# Altium project SDR_PMR.PrjPcb (part 3 of 12)

## Sheet M12_Connector.SchDoc
size A4; DocumentNumber: 1; SheetNumber: 15; SheetTotal: 18
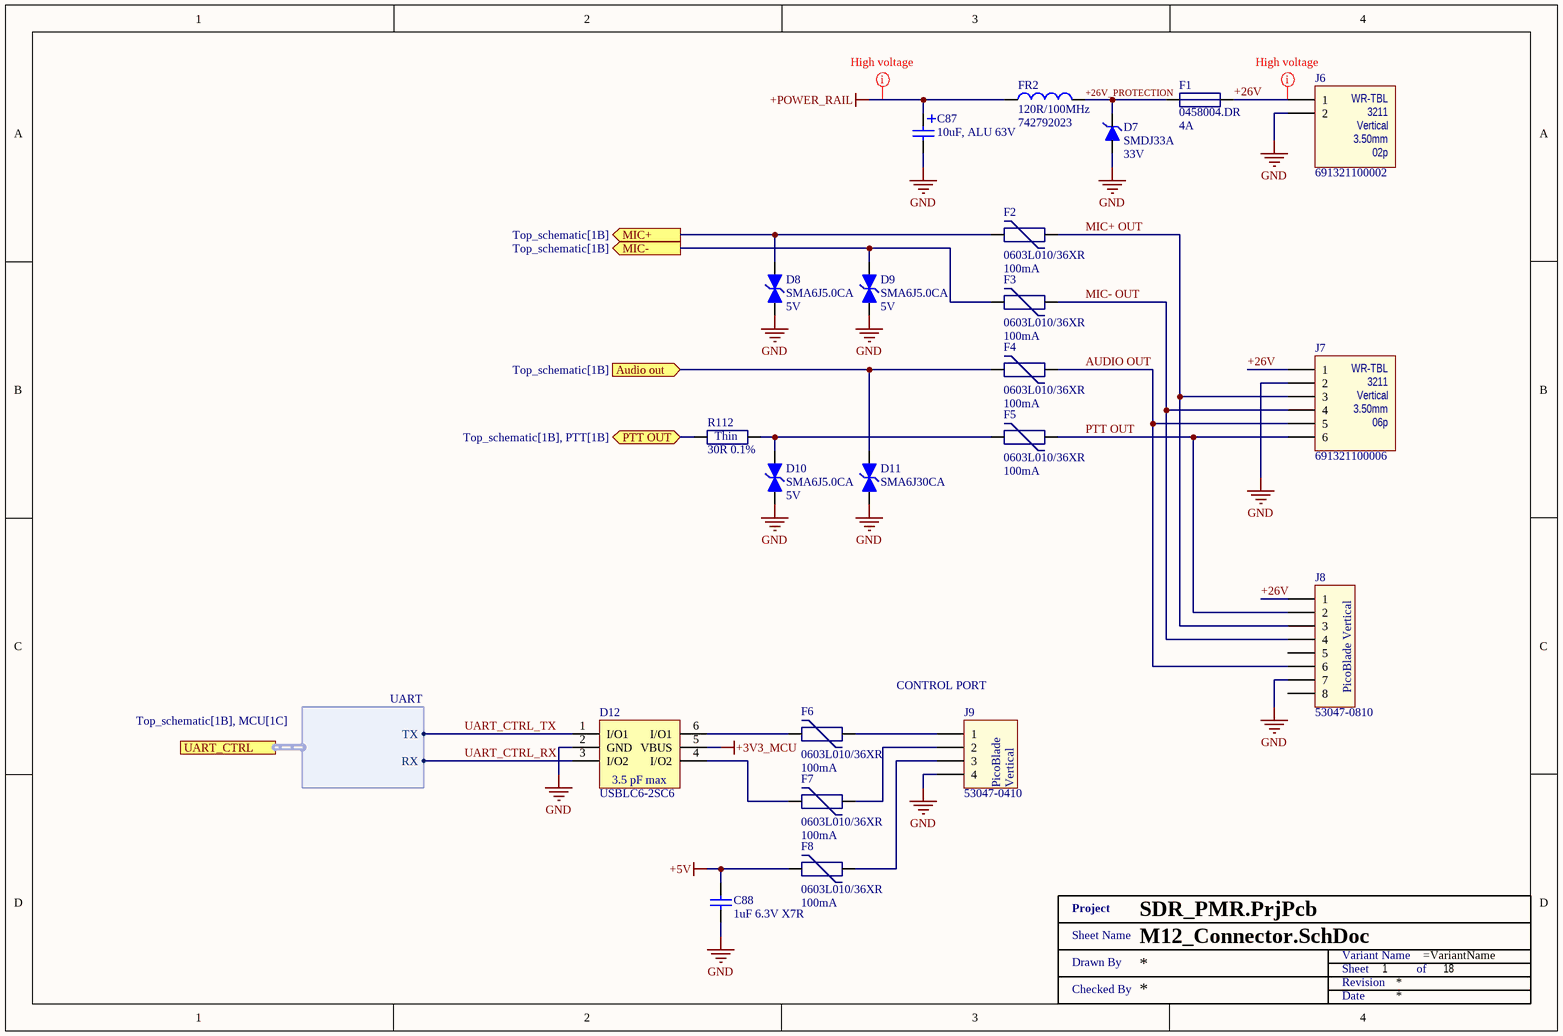
[diagram p2: M12_Connector.SchDoc]

### Parts
(Parts that share a designator on the sheet are numbered #1, #2 ... from top to bottom, then left to right.)
C87  10uF, ALU 63V  [WCAP-ATLI_5x11x2]
C88  1uF 6.3V X7R  [SMD0402]
D7  SMDJ33A  Reverse Standoff Voltage: 33V  [DO-214AB]
D8  SMA6J5.0CA  Reverse Standoff Voltage: 5V  [DO-214AC]
D9  SMA6J5.0CA  Reverse Standoff Voltage: 5V  [DO-214AC]
D10  SMA6J5.0CA  Reverse Standoff Voltage: 5V  [DO-214AC]
D11  SMA6J30CA  [DO-214AC]
D12  USBLC6-2SC6  [SOT23-6L]
F1  0458004.DR  Current Rating: 4A  [SMD1206 - FUSE]
F2  0603L010/36XR  I_hold: 100mA  [SMD0603 - PTC]
F3  0603L010/36XR  I_hold: 100mA  [SMD0603 - PTC]
F4  0603L010/36XR  I_hold: 100mA  [SMD0603 - PTC]
F5  0603L010/36XR  I_hold: 100mA  [SMD0603 - PTC]
F6  0603L010/36XR  I_hold: 100mA  [SMD0603 - PTC]
F7  0603L010/36XR  I_hold: 100mA  [SMD0603 - PTC]
F8  0603L010/36XR  I_hold: 100mA  [SMD0603 - PTC]
FR2  120R/100MHz  [SMD0805 - R]
J6  691321100002  [691321100002]
J7  691321100006  [691321100006]
J8  53047-0810  [530470810]
J9  53047-0410  [530470410]
R112  30R 0.1%  [SMD0402 - R]
XX?#3  Title 1  (value not drawn)  (graphical)

### Ports
Audio out (in, see Top_schematic[1B]), MIC+ (out, see Top_schematic[1B]), MIC- (out, see Top_schematic[1B]), PTT OUT (bidir, see Top_schematic[1B], PTT[1B]), UART_CTRL (harness UART, see Top_schematic[1B], MCU[1C])

### Harnesses
UART: TX, RX

### Nets
+3V3_MCU: D12.5(VBUS)
+5V: C88.2 F8.1
+POWER_RAIL: C87.1 FR2.1
GND: C87.2 C88.1 D7.2 D8.1(A) D9.1(A) D10.1(A) D11.1(A) D12.2(GND) J6.2 J7.2 J8.7 J9.4
+26V: F1.2 J6.1 J7.1 J8.1
+26V_PROTECTION: D7.1 F1.1 FR2.2
AUDIO OUT: F4.2 J7.5 J8.6
MIC+ OUT: F2.2 J7.3 J8.3
MIC- OUT: F3.2 J7.4 J8.4
PTT OUT: F5.2 J7.6 J8.2
UART_CTRL_RX: D12.3(I/O2) ; port UART_CTRL.RX
UART_CTRL_TX: D12.1(I/O1) ; port UART_CTRL.TX
NetC4_1: D9.2(K) F3.1 ; port MIC-
NetC4_2: D8.2(K) F2.1 ; port MIC+
NetC63_2: D11.2(K) F4.1 ; port Audio out
NetD10_2: D10.2(K) F5.1 R112.2
NetD12_4: D12.4(I/O2) F7.1
NetD12_6: D12.6(I/O1) F6.1
NetF6_2: F6.2 J9.1
NetF7_2: F7.2 J9.2
NetF8_2: F8.2 J9.3
NetR109_1: R112.1 ; port PTT OUT

Not connected (* = marked no-connect by the designer): J8 5 8

### Layout directives
net class HV: +26V, +POWER_RAIL

### Notes on the sheet
- (near J9) CONTROL PORT
- (in symbol 53047-0410) PicoBlade; Vertical
- (in symbol 53047-0810) PicoBlade Vertical
- (in symbol 691321100002) WR-TBL; 3211; 3.50mm; 02p
- (in symbol 691321100006) WR-TBL; 3211; 3.50mm; 06p
- (in symbol TC0225B300JTCC) Thin
- (in symbol Title 1) Project; Sheet Name; Variant Name; Drawn By; Sheet; of; Revision; Checked By; Date
- (in symbol USBLC6-2SC6) 3.5 pF max

### Library data of the parts
C87 = 860080772001: WURTH ELEKTRONIK - 860080772001 - CAP, ALU ELEC, 10UF, 63V, RADIAL; Ripple Current: 135mA @ 100kHz; Capacitance: 10u; Manufacturer: WURTH ELEKTRONIK; Manufacturer Part Number: 860080772001; RoHS: YES; Stock 1: 553; Pricing 1: 1=0.0957, 3=0.091, 5=0.0863, 10=0.0825, 20=0.0786, 50=0.0692, 250=0.0647, 500=0.0564 (GBP); ComponentLink1URL: http://www.farnell.com/datasheets/1879798.pdf; ComponentLink1Description: http://www.farnell.com/datasheets/1879798.pdf; Voltage Rating: 63V; Stock 3: 2136; Pricing 3: 1=0.62, 50=0.335, 100=0.289, 250=0.259, 500=0.235, 1500=0.202, 7500=0.182, 15000=0.178 (GBP); ComponentLink2URL: http://www.farnell.com/datasheets/2065186.pdf; ComponentLink2Description: http://www.farnell.com/datasheets/2065186.pdf; Supplier 1: Mouser; Supplier Part Number 1: 710-860080772001; Supplier 2: Farnell; Supplier Part Number 2: 2465955; Supplier 3: Digi-Key; Supplier Part Number 3: 732-9121-1-ND
C88 = TCC0402X7R105K6R3AT: Capacitor: MLCC; SMD; 0402; 1µF; 6.3V; ±10%; X7R; CCTC; Capacitance: 1u; Supplier 1: LCSC; Supplier Part Number 1: C5448871; Manufacturer: CCTC; Manufacturer Part Number: TCC0402X7R105K6R3AT; Category: Ceramic Capacitors; Stock 1: 242350; Pricing 1: 50=0.0089, 500=0.0072, 1500=0.0063, 10000=0.0058, 20000=0.0053, 50000=0.005 (USD); ComponentLink1URL: https://datasheet.octopart.com:443/TCC0402X7R105K6R3AT-CCTC-datasheet-194166649.pdf?src-supplier=LCSC; ComponentLink1Description: https://datasheet.octopart.com:443/TCC0402X7R105K6R3AT-CCTC-datasheet-194166649.pdf?src-supplier=LCSC; ComponentLink2URL: https://datasheet.octopart.com:443/TCC0402X7R105K6R3AT-CCTC-datasheet-192317456.pdf?src-supplier=HQonline; ComponentLink2Description: https://datasheet.octopart.com:443/TCC0402X7R105K6R3AT-CCTC-datasheet-192317456.pdf?src-supplier=HQonline
D7 = SMDJ33A: SMDJ Series 3000 W 33 V Surface Mount Uni-Directional TVS Diode - DO-214AB; Manufacturer: Littelfuse; Number of Unidirectional Channels: 1; Min Breakdown Voltage: 36.7V; Clamping Voltage: 53.3V; Peak Pulse Power: 3kW; Power Line Protection: No; Peak Pulse Current: 56.3A; Polarity: Unidirectional; Test Current: 1mA; Leakage Current: 2uA; Max Breakdown Voltage: 40.6V; Max Power Dissipation: 6.5W; Element Configuration: Single; Supplier 1: Mouser; Supplier Part Number 1: 576-SMDJ33A; Manufacturer Part Number: SMDJ33A; RoHS: Yes; Category: TVS Diodes; Stock 1: 163; Pricing 1: 1=0.96000, 10=0.85500, 50=0.85500, 100=0.66700, 1000=0.42200, 10000=0.40800 (USD); Mount: Surface Mount; Case/Package: SMC; Number of Pins: 2; Min Operating Temperature: -65°C; Max Operating Temperature: 150°C; Packaging: Tape and Reel; Resistor Type: Zener; Reverse Breakdown Voltage: 36.7V; Package Quantity: 3000; Number of Elements: 1; Direction: Unidirectional; Operating Supply Voltage: 33V; Max Surge Current: 56.3A; Breakdown Voltage: 36.7V; Number of Channels: 1; Termination: SMD/SMT; Power Dissipation: 3kW; Max Reverse Leakage Current: 2uA; Length: 7.11mm; Width: 6.22mm; Height: 2.417mm; RoHS Compliant: Yes; Lead Free: Lead Free; REACH SVHC: No SVHC; ComponentLink1URL: https://datasheet.ciiva.com/25624/0900766b810f4f0f-25624824.pdf?src-supplier=RSComponents; ComponentLink1Description: https://datasheet.ciiva.com/25624/0900766b810f4f0f-25624824.pdf?src-supplier=RSComponents; ComponentLink2URL: https://datasheet.ciiva.com/16487/littelfuse-tvs-diode-smdj-datasheet-16487922.pdf?src-supplier=Future+Electronics; ComponentLink2Description: https://datasheet.ciiva.com/16487/littelfuse-tvs-diode-smdj-datasheet-16487922.pdf?src-supplier=Future+Electronics; ComponentLink3URL: https://datasheet.ciiva.com/14162/smdj-eng-ds-14162013.pdf?src-supplier=Distrelec; ComponentLink3Description: https://datasheet.ciiva.com/14162/smdj-eng-ds-14162013.pdf?src-supplier=Distrelec; ComponentLink4URL: https://datasheet.ciiva.com/8062/littelfuse-tvs-diodes-smdj-8062394.pdf?src-supplier=Element14; ComponentLink4Description: https://datasheet.ciiva.com/8062/littelfuse-tvs-diodes-smdj-8062394.pdf?src-supplier=Element14; ComponentLink5URL: https://datasheet.ciiva.com/4510/littelfuse-tvs-diode-smdj-datasheet-pdf-4510185.pdf?src-supplier=Mouser; ComponentLink5Description: https://datasheet.ciiva.com/4510/littelfuse-tvs-diode-smdj-datasheet-pdf-4510185.pdf?src-supplier=Mouser; ComponentLink6URL: https://datasheet.ciiva.com/332/littelfuse-tvs-diode-smdj-datasheet-pdf-332697.pdf?src-supplier=Digi-Key; ComponentLink6Description: https://datasheet.ciiva.com/332/littelfuse-tvs-diode-smdj-datasheet-pdf-332697.pdf?src-supplier=Digi-Key; ComponentLink7URL: https://datasheet.ciiva.com/332/littelfuse-tvs-diode-smdj-datasheet-pdf-332698.pdf?src-supplier=Digi-Key; ComponentLink7Description: https://datasheet.ciiva.com/332/littelfuse-tvs-diode-smdj-datasheet-pdf-332698.pdf?src-supplier=Digi-Key; ComponentLink8URL: https://datasheet.ciiva.com/332/littelfuse-tvs-diode-smdj-datasheet-pdf-332696.pdf?src-supplier=Digi-Key; ComponentLink8Description: https://datasheet.ciiva.com/332/littelfuse-tvs-diode-smdj-datasheet-pdf-332696.pdf?src-supplier=Digi-Key; Supplier 2: Farnell; Supplier Part Number 2: 1827630; Supplier 3: RSComponents; Supplier Part Number 3: 7645717P
D8-D10 = SMA6J5.0CA: ESD Suppressors / TVS Diodes 600W 5V 5% Bi-Directional; Manufacturer: Littelfuse; Supplier 1: Mouser; Supplier Part Number 1: 576-SMA6J5.0CA; Manufacturer Part Number: SMA6J5.0CA; RoHS: Yes; Category: TVS Diodes; Stock 1: 57321; Pricing 1: 1=0.41, 10=0.35, 50=0.35, 100=0.243, 1000=0.139, 10000=0.115 (USD); ComponentLink1URL: http://www.farnell.com/datasheets/2736094.pdf?src-supplier=Farnell; ComponentLink1Description: http://www.farnell.com/datasheets/2736094.pdf?src-supplier=Farnell; ComponentLink2URL: https://datasheet.octopart.com/SMA6J5.0CA-Littelfuse-datasheet-114785799.pdf?src-supplier=Future+Electronics; ComponentLink2Description: https://datasheet.octopart.com/SMA6J5.0CA-Littelfuse-datasheet-114785799.pdf?src-supplier=Future+Electronics; ComponentLink3URL: https://www.littelfuse.com/~/media/electronics/datasheets/tvs_diodes/littelfuse_tvs_diode_sma6j_datasheet.pdf.pdf?src-supplier=Digi-Key; ComponentLink3Description: https://www.littelfuse.com/~/media/electronics/datasheets/tvs_diodes/littelfuse_tvs_diode_sma6j_datasheet.pdf.pdf?src-supplier=Digi-Key; ComponentLink4URL: http://www.farnell.com/datasheets/2736094.pdf?src-supplier=Newark; ComponentLink4Description: http://www.farnell.com/datasheets/2736094.pdf?src-supplier=Newark; ComponentLink5URL: http://www.farnell.com/datasheets/2736094.pdf?src-supplier=Element14; ComponentLink5Description: http://www.farnell.com/datasheets/2736094.pdf?src-supplier=Element14; Supplier 2: Farnell; Supplier Part Number 2: 3010381; Supplier 3: Digi-Key; Supplier Part Number 3: 18-SMA6J5.0CACT-ND
D11 = SMA6J30CA: TVS DIODE 30VWM 48.4VC DO214 TR / 48.4V Clamp 12.5A Ipp Tvs Diode Surface Mount DO-214AC (SMA); Manufacturer: Littelfuse; Breakdown Voltage: 35.05V; Max Breakdown Voltage: 33.3V; Max Power Dissipation: 3.3W; Max Reverse Leakage Current: 1µA; Number of Channels: 1; Peak Pulse Power: 600W; Polarity: Bidirectional; Reverse Standoff Voltage: 30V; Test Current: 1mA; Manufacturer Part Number: SMA6J30CA; RoHS: Compliant; Category: TVS Diodes; Stock 1: 7847; Pricing 1: 1=0.57, 10=0.348, 50=0.348, 100=0.222, 1000=0.15, 10000=0.104 (USD); Clamping Voltage: 48.4V; Country of Origin: Malaysia; Export Control Classification Number (ECCN) Code: EAR99; Harmonized Tariff Schedule (HTS) Code: 8541.10.00.50; Introduction Date: 2017-10-30; Lifecycle Status: Production; Max Operating Temperature: 150°C; Min Breakdown Voltage: 33.3V; Min Operating Temperature: -65°C; Number of Elements: 1; Number of Terminals: 2; Peak Pulse Current: 12.5A; Peak Reverse Current: 1µA; REACH SVHC: No; Reverse Voltage: 30V; ComponentLink1URL: https://datasheet.octopart.com:443/SMA6J30CA-Littelfuse-datasheet-158204057.pdf?src-supplier=IHS; ComponentLink1Description: https://datasheet.octopart.com:443/SMA6J30CA-Littelfuse-datasheet-158204057.pdf?src-supplier=IHS; ComponentLink2URL: https://datasheet.octopart.com:443/SMA6J30CA-Littelfuse-datasheet-159141416.pdf?src-supplier=Newark; ComponentLink2Description: https://datasheet.octopart.com:443/SMA6J30CA-Littelfuse-datasheet-159141416.pdf?src-supplier=Newark; ComponentLink3URL: https://datasheet.octopart.com:443/SMA6J30CA-Littelfuse-datasheet-178267327.pdf?src-supplier=Burklin+Elektronik; ComponentLink3Description: https://datasheet.octopart.com:443/SMA6J30CA-Littelfuse-datasheet-178267327.pdf?src-supplier=Burklin+Elektronik; ComponentLink4URL: https://datasheet.octopart.com:443/SMA6J30CA-Littelfuse-datasheet-114785799.pdf?src-supplier=Littelfuse+SCT; ComponentLink4Description: https://datasheet.octopart.com:443/SMA6J30CA-Littelfuse-datasheet-114785799.pdf?src-supplier=Littelfuse+SCT; Supplier 1: Mouser; Supplier Part Number 1: 576-SMA6J30CA; Supplier 2: LCSC; Supplier Part Number 2: C1977655
D12 = USBLC6-2SC6: STMicroelectronics Uni-Directional TVS Diode Array, 17V Vcl Max, SMD, SOT-23, 6V Vbr Min; Value: 2.5pF; Data Rate: 480Mbps; Direction: Unidirectional; Element Configuration: Dual; ESD Protection: Yes; Forward Voltage: 1.1V; Leakage Current: 150nA; Max Junction Temperature (Tj): 125°C; Max Repetitive Reverse Voltage (Vrrm): 5.25V; Number of Bidirectional Channels: 2; Number of Elements: 1; Peak Pulse Current: 5A; Reverse Standoff Voltage: 5V; Test Current: 1mA; Manufacturer: STMicroelectronics; Manufacturer Part Number: USBLC6-2SC6; RoHS: Compliant; Category: TVS Diodes; Pricing 1: 1=0.47, 10=0.292, 50=0.292, 100=0.204, 500=0.131, 1000=0.14, 3000=0.094, 6000=0.085, 9000=0.081, 10000=0.086, 24000=0.073 (USD); Breakdown Voltage: 6V; Case/Package: SOT-23; China RoHS: Compliant; Clamping Voltage: 17V; Contact Plating: Tin; Country of Origin: Mainland China; Depth: 1.75mm; Export Control Classification Number (ECCN) Code: EAR99; Height: 1.45mm; Harmonized Tariff Schedule (HTS) Code: 8541.10.00.50; Introduction Date: 2005-03-15; Lead Free: Lead Free; Length: 3.05mm; Lifecycle Status: Production; Max Breakdown Voltage: 6V; Max Operating Temperature: 125°C; Max Reverse Leakage Current: 150nA; Min Breakdown Voltage: 6V; Min Operating Temperature: -40°C; Mounting Technology: Surface Mount; Number of Channels: 2; Pins: 6; Number of Terminals: 6; Operating Supply Voltage: 1.1V; Peak Reverse Current: 150nA; Polarity: Unidirectional; Power Line Protection: Yes; Radiation Hardening: No; REACH SVHC: Yes; Reverse Breakdown Voltage: 6V; Schedule B: 8536300000, 8536300000|8536300000|8536300000|8536300000|8536300000|8536300000|8536300000|8536300000|8536300000|8536300000|8536300000|8536300000|8536300000|8536300000|8536300000|8536300000|8536300000|8536300000|8536300000|8536300000|8536300000|8536300000|8536300000|85; Termination: SMD/SMT; Width: 1.75mm; Working Voltage: 5V; ComponentLink1URL: https://datasheet.octopart.com:443/USBLC6-2SC6-STMicroelectronics-datasheet-10412581.pdf?src-supplier=Newark; ComponentLink1Description: https://datasheet.octopart.com:443/USBLC6-2SC6-STMicroelectronics-datasheet-10412581.pdf?src-supplier=Newark; ComponentLink2URL: https://datasheet.octopart.com:443/USBLC6-2SC6-STMicroelectronics-datasheet-181961833.pdf?src-supplier=Newark; ComponentLink2Description: https://datasheet.octopart.com:443/USBLC6-2SC6-STMicroelectronics-datasheet-181961833.pdf?src-supplier=Newark; ComponentLink3URL: https://datasheet.octopart.com:443/USBLC6-2SC6-STMicroelectronics-datasheet-525477.pdf?src-supplier=Factory+Futures; ComponentLink3Description: https://datasheet.octopart.com:443/USBLC6-2SC6-STMicroelectronics-datasheet-525477.pdf?src-supplier=Factory+Futures; ComponentLink4URL: https://datasheet.octopart.com:443/USBLC6-2SC6-STMicroelectronics-datasheet-82998616.pdf?src-supplier=Farnell; ComponentLink4Description: https://datasheet.octopart.com:443/USBLC6-2SC6-STMicroelectronics-datasheet-82998616.pdf?src-supplier=Farnell; ComponentLink5URL: https://datasheet.octopart.com:443/USBLC6-2SC6-STMicroelectronics-datasheet-46285.pdf?src-supplier=Farnell; ComponentLink5Description: https://datasheet.octopart.com:443/USBLC6-2SC6-STMicroelectronics-datasheet-46285.pdf?src-supplier=Farnell; ComponentLink6URL: https://datasheet.octopart.com:443/USBLC6-2SC6-STMicroelectronics-datasheet-14050643.pdf?src-supplier=iiiC; ComponentLink6Description: https://datasheet.octopart.com:443/USBLC6-2SC6-STMicroelectronics-datasheet-14050643.pdf?src-supplier=iiiC; ComponentLink7URL: https://datasheet.octopart.com:443/USBLC6-2SC6-STMicroelectronics-datasheet-10521292.pdf?src-supplier=Jameco+(USA); ComponentLink7Description: https://datasheet.octopart.com:443/USBLC6-2SC6-STMicroelectronics-datasheet-10521292.pdf?src-supplier=Jameco+(USA); Supplier 1: Mouser; Supplier Part Number 1: 511-USBLC6-2SC6; Supplier 2: LCSC; Supplier Part Number 2: C2687116
F1 = 0458004.DR: FUSE BRD MNT 4A 32VAC 75VDC 1206; Manufacturer: Littelfuse; Voltage Rating (AC): 32V; Voltage Rating (DC): 75V; Resistance: 32mR; Fuse Type: Board Mount (Cartridge Style Excluded); Approvals: cULus; Supplier 1: Mouser; Supplier Part Number 1: 576-0458004.DR; Manufacturer Part Number: 0458004.DR; Stock 1: 3670; Pricing 1: 1 = 1.36000, 10 = 1.03000, 50 = 1.03000, 100 = 0.85300, 1000 = 0.70300, 10000 = 0.50800 (USD); RoHS: Yes; Mount: Surface Mount; Case/Package: 1206; Number of Pins: 2; Case Code (Metric): 3216; Case Code (Imperial): 1206; Housing Material: Ceramic; Min Operating Temperature: -55°C; Max Operating Temperature: 125°C; Packaging: Tape and Reel; Package Quantity: 1500; DC Cold Resistance: 32mR; Fuse Current: 4A; Length: 3.18mm; Height: 0.062inch; Width: 1.575mm; Depth: 1.58mm; Radiation Hardening: No; REACH SVHC: Unknown; ComponentLink1URL: https://datasheet.ciiva.com/26923/getdatasheetpartid-767176-26923399.pdf?src-supplier=Verical; ComponentLink1Description: https://datasheet.ciiva.com/26923/getdatasheetpartid-767176-26923399.pdf?src-supplier=Verical; ComponentLink2URL: https://datasheet.ciiva.com/299/littelfuse-fuse-458-series-299817.pdf?src-supplier=Digi-Key; ComponentLink2Description: https://datasheet.ciiva.com/299/littelfuse-fuse-458-series-299817.pdf?src-supplier=Digi-Key; ComponentLink3URL: https://datasheet.ciiva.com/299/littelfuse-fuse-458-series-299818.pdf?src-supplier=Digi-Key; ComponentLink3Description: https://datasheet.ciiva.com/299/littelfuse-fuse-458-series-299818.pdf?src-supplier=Digi-Key; ComponentLink4URL: https://datasheet.ciiva.com/1730/337915-1730546.pdf?src-supplier=Newark; ComponentLink4Description: https://datasheet.ciiva.com/1730/337915-1730546.pdf?src-supplier=Newark; ComponentLink5URL: https://datasheet.ciiva.com/1549/1846043-1549636.pdf?src-supplier=Element14; ComponentLink5Description: https://datasheet.ciiva.com/1549/1846043-1549636.pdf?src-supplier=Element14; ComponentLink6URL: https://datasheet.ciiva.com/299/littelfuse-fuse-458-series-299816.pdf?src-supplier=Digi-Key; ComponentLink6Description: https://datasheet.ciiva.com/299/littelfuse-fuse-458-series-299816.pdf?src-supplier=Digi-Key; Supplier 2: Farnell; Supplier Part Number 2: 1702535; Stock 2: 1286; Supplier 3: Arrow; Supplier Part Number 3: 0458004.DR; Stock 3: 1320; Pricing 3: 1 = 1.18390, 10 = 1.00720, 25 = 1.00660, 100 = 0.75800, 250 = 0.68220, 500 = 0.67760, 1000 = 0.67740 (USD); Supplier 4: Digi-Key; Supplier Part Number 4: F2936CT-ND; Stock 4: 11028; Pricing 4: 1 = 1.43000, 5 = 1.38400, 10 = 1.29500, 50 = 1.07180, 100 = 0.89320, 250 = 0.87088, 500 = 0.73690 (USD)
F2-F8 = 0603L010/36XR: PTC RESET FUSE 36V 100mA 0603; I trip: 300mA; Supplier 1: LCSC; Supplier Part Number 1: C7472522; V max: 36V
FR2 = 742792023: WURTH ELEKTRONIK - 742792023 - FERRITE BEAD, 0.03OHM, 3A, 0805; Impedance @ 100MHz: 120; Ferrite Case Style: 0805 [2012 Metric]; DC Current Rating: 3; DC Resistance Max: 0.03; Impedance Tolerance: ± 25%; Ferrite Mounting: SMD; Resistance: 0.03ohm<!--FANDB--><div class="features-and-benefits-container"><div class="features-and-benefits-description"><span class="features-benefits-value">The 742792023 is a SMD EMI Suppression Ferrite Bead with 0805 case and reliable Ni-Sn electrodes. It can be put directly on the printed circuit board. It offers excellent anti-EMI properties and low DC resistance. Placed very close next to the interference source even with smallest size 0402, maximal impedance at 1000; Manufacturer: WURTH ELEKTRONIK; RoHS: YES; Stock 1: 4283; Pricing 1: 1=0,123, 50=0,112, 100=0,103, 500=0,0937, 1000=0,0877, 2000=0,0846 (GBP); Product Range: -; Automotive Qualification Standard: -; Packaging: Cut Tape; ComponentLink1URL: http://www.farnell.com/datasheets/1695980.pdf; ComponentLink1Description: http://www.farnell.com/datasheets/1695980.pdf; ComponentLink2URL: http://www.farnell.com/cad/1670054.zip; ComponentLink2Description: http://www.farnell.com/cad/1670054.zip; Supplier 1: Mouser; Supplier Part Number 1: 710-742792023; Supplier 2: Farnell; Supplier Part Number 2: 1635732; Supplier 3: Digi-Key; Supplier Part Number 3: 732-1613-1-ND; Manufacturer Part Number: 742792023
J6 = 691321100002: WR-TBL Series 3211 - 3.50 mm Vertical PCB Header; Manufacturer: Wurth Electronics; Number of Positions Per Level: 2; Number of Levels: 1; Current: 10A; Voltage: 300V; Pitch: 0.138inch; Supplier: Mouser; Supplier Part Number: 710-691321100002; Manufacturer Part Number: 691321100002; RoHS: Yes; Category: Terminal Blocks; Stock: 2512; Pricing: 1=0.44, 10=0.394, 50=0.34, 100=0.305, 1000=0.269, 10000=0.268 (USD); Mounting Technology: Through Hole; Color: Green; Contact Material: Brass; Package Quantity: 1000; Packaging: Bulk; Number of Rows: 1; Termination: Solder; Number of Contacts: 2; Orientation: Vertical; Series: WR-TBL Series 3211; Voltage Rating: 300V; Length: 7mm; Width: 8.1mm; Height: 12.7mm; RoHS Compliant: Yes; Reach SVHC Compliant: Unknown; Lead Free: 5697LeadFree; ComponentLink1URL: https://datasheet.ciiva.com/8043/1442231-8043542.pdf?src-supplier=Element14; ComponentLink1Description: https://datasheet.ciiva.com/8043/1442231-8043542.pdf?src-supplier=Element14; ComponentLink2URL: https://datasheet.ciiva.com/795/6913211000xx-795780.pdf?src-supplier=Digikey; ComponentLink2Description: https://datasheet.ciiva.com/795/6913211000xx-795780.pdf?src-supplier=Digikey; ComponentLink3URL: https://datasheet.ciiva.com/48692/001088697-da-01-en-wr-tbl-terminal-block3211-691321100002-48692842.pdf?src-supplier=Conrad; ComponentLink3Description: https://datasheet.ciiva.com/48692/001088697-da-01-en-wr-tbl-terminal-block3211-691321100002-48692842.pdf?src-supplier=Conrad; Supplier 1: Mouser; Supplier Part Number 1: 710-691321100002; Supplier 2: Farnell; Supplier Part Number 2: 1841308; Supplier 3: Digikey; Supplier Part Number 3: 732-2763-ND
J7 = 691321100006: WR-TBL Series 3211 - 3.50 mm Vertical PCB Header; Manufacturer: Wurth Electronics; Current Rating: 10.5A; Number of Positions Per Level: 6; Number of Levels: 1; Current: 10A; Voltage: 300V; Pitch: 0.138inch; Supplier: Mouser; Supplier Part Number: 710-691321100006; Manufacturer Part Number: 691321100006; RoHS: Yes; Category: Terminal Blocks; Stock: 612; Pricing: 1=1.32, 10=1.18, 50=1.02, 100=0.914, 1000=0.805, 10000=0.804 (USD); Mounting Technology: Through Hole; Color: Green; Contact Material: Brass; Number of Rows: 1; Package Quantity: 520; Packaging: Bulk; Termination: Solder; Number of Contacts: 6; Contact Gender: Male; Orientation: Vertical; Series: WR-TBL Series 3211; Length: 7mm; Width: 25.6mm; Height: 12.7mm; RoHS Compliant: Yes; Reach SVHC Compliant: Unknown; ComponentLink1URL: https://datasheet.ciiva.com/8043/1442231-8043549.pdf?src-supplier=Element14; ComponentLink1Description: https://datasheet.ciiva.com/8043/1442231-8043549.pdf?src-supplier=Element14; ComponentLink2URL: https://datasheet.ciiva.com/796/6913211000xx-796060.pdf?src-supplier=Digikey; ComponentLink2Description: https://datasheet.ciiva.com/796/6913211000xx-796060.pdf?src-supplier=Digikey; ComponentLink3URL: https://datasheet.ciiva.com/48692/001088701-da-01-en-wr-tbl-terminal-block3211-691321100006-48692844.pdf?src-supplier=Conrad; ComponentLink3Description: https://datasheet.ciiva.com/48692/001088701-da-01-en-wr-tbl-terminal-block3211-691321100006-48692844.pdf?src-supplier=Conrad; Supplier 1: Mouser; Supplier Part Number 1: 710-691321100006; Supplier 2: Farnell; Supplier Part Number 2: 1841313; Supplier 3: Digikey; Supplier Part Number 3: 732-2767-ND
J8 = 53047-0810: 1.25mm Pitch, PicoBlade PCB Header, Single Row, Vertical, Through Hole, Tin Plating, Friction Lock, 8 Circuits, Tray, 2.30mm PC Tail Length; Manufacturer: Molex; Number of Contacts: 8; Contact Resistance: 20mR; Gender: Male; Current Rating: 1A; Voltage Rating: 125V; Insulation Resistance: 100MR; Glow Wire Compliant: Non-compliant; Supplier 1: Mouser; Supplier Part Number 1: 538-53047-0810; Manufacturer Part Number: 53047-0810; Stock 1: 13800; Pricing 1: 1 = 0.50000, 10 = 0.48300, 50 = 0.48300, 100 = 0.38300, 1000 = 0.29100, 10000 = 0.22600 (USD); RoHS: Yes; Mount: Through Hole; Case/Package: 0810; Contact Plating: Tin; Contact Material: Bronze; Color: Natural; Housing Color: Natural; Housing Material: Polyamide; Min Operating Temperature: -40°C; Max Operating Temperature: 85°C; Termination: Through Hole; Number of Rows: 1; Orientation: Vertical; Packaging: Tray; Number of Positions: 8; Package Quantity: 2000; Voltage Rating (DC): 125V; Number of Circuits: 8; Pitch: 1.25mm; Radiation Hardening: No; REACH SVHC: Unknown; Lead Free: Lead Free; Flammability Rating: UL94 V-0; ComponentLink1URL: https://datasheet.ciiva.com/30110/64290530470810-pcb-headers-30110449.pdf?src-supplier=Onlinecomponents.com; ComponentLink1Description: https://datasheet.ciiva.com/30110/64290530470810-pcb-headers-30110449.pdf?src-supplier=Onlinecomponents.com; ComponentLink2URL: https://datasheet.ciiva.com/5155/0530470810-pcb-headers-170988-5155236.pdf?src-supplier=Mouser; ComponentLink2Description: https://datasheet.ciiva.com/5155/0530470810-pcb-headers-170988-5155236.pdf?src-supplier=Mouser; ComponentLink3URL: https://datasheet.ciiva.com/11747/0900766b8024e2fd-11747012.pdf?src-supplier=RSComponents; ComponentLink3Description: https://datasheet.ciiva.com/11747/0900766b8024e2fd-11747012.pdf?src-supplier=RSComponents; ComponentLink4URL: https://datasheet.ciiva.com/25291/1815828-25291355.pdf?src-supplier=Newark; ComponentLink4Description: https://datasheet.ciiva.com/25291/1815828-25291355.pdf?src-supplier=Newark; ComponentLink5URL: https://datasheet.ciiva.com/34303/1932504-34303339.pdf?src-supplier=Jameco; ComponentLink5Description: https://datasheet.ciiva.com/34303/1932504-34303339.pdf?src-supplier=Jameco; ComponentLink6URL: https://datasheet.ciiva.com/16658/0530470810-pcb-headers-16658422.pdf?src-supplier=Avnet+Europe; ComponentLink6Description: https://datasheet.ciiva.com/16658/0530470810-pcb-headers-16658422.pdf?src-supplier=Avnet+Europe; ComponentLink7URL: https://datasheet.ciiva.com/17025/70266944-17025467.pdf?src-supplier=Allied+Electronics; ComponentLink7Description: https://datasheet.ciiva.com/17025/70266944-17025467.pdf?src-supplier=Allied+Electronics; ComponentLink8URL: https://datasheet.ciiva.com/14156/ge116819-116832-e-14156239.pdf?src-supplier=Distrelec; ComponentLink8Description: https://datasheet.ciiva.com/14156/ge116819-116832-e-14156239.pdf?src-supplier=Distrelec; Supplier 2: Avnet; Supplier Part Number 2: 0530470810; Stock 2: 6079; Pricing 2: 1 = 0.24815, 10 = 0.22867, 25 = 0.21440, 50 = 0.20775, 100 = 0.20181 (USD); Supplier 3: Farnell; Supplier Part Number 3: 1012258; Stock 3: 17670; Supplier 4: Arrow; Supplier Part Number 4: 53047-0810; Stock 4: 10054; Pricing 4: 1 = 0.35700, 10 = 0.34100, 100 = 0.26730, 500 = 0.24440, 2000 = 0.21170, 6000 = 0.19700, 10000 = 0.18630, 1 = 0.58990, 10 = 0.54650, 100 = 0.37790, 500 = 0.32560, 2000 = 0.25820, 6000 = 0.24640, 2000 = 0.30960, 1 = 0.56010, 10 = 0.53030, 100 = 0.39670, 500 = 0.39230 (USD); Supplier 5: Digi-Key; Supplier Part Number 5: WM1737-ND; Stock 5: 16575; Pricing 5: 1 = 0.54000, 10 = 0.50500, 100 = 0.38690, 500 = 0.33644, 2000 = 0.26915, 6000 = 0.24392, 10000 = 0.22710 (USD)
J9 = 53047-0410: 1.25mm Pitch, PicoBlade PCB Header, Single Row, Vertical, Through Hole, Tin Plating, Friction Lock, 4 Circuits, Tray, 2.30mm PC Tail Length; Manufacturer: Molex; Manufacturer Part Number: 0530470410; Number of Positions: 4; Max Voltage Rating (AC): 125V; Contact Resistance: 20mR; Connector Type: Blade Pin; RoHS: Yes; Category: Headers and Wire Housings; Stock 4: 7971; Pricing 4: 1=0,27000, 10=0,23400, 100=0,18000, 500=0,15400, 1000=0,13000, 5000=0,11200, 10000=0,10400 (USD); Mount: Through Hole; Housing Material: Nylon; Contact Plating: Tin; Contact Material: Bronze; Color: Natural; Housing Color: White; Min Operating Temperature: -40°C; Max Operating Temperature: 85°C; Termination: Solder; Number of Contacts: 4; Packaging: Tray; Number of Rows: 1; Orientation: Straight; Length: 6.75mm; Pitch: 1.25mm; Contact Mating Length: 0.089inch; Depth: 3.2mm; ComponentLink1URL: https://datasheet.ciiva.com/3934/87920530470410-pcb-headers-3934064.pdf?src-supplier=Arrow; ComponentLink1Description: https://datasheet.ciiva.com/3934/87920530470410-pcb-headers-3934064.pdf?src-supplier=Arrow; Supplier 1: Mouser; Supplier Part Number 1: 538-53047-0410; Supplier 2: Farnell; Supplier Part Number 2: 9733060; Supplier 3: Digi-Key; Supplier Part Number 3: WM1733-ND; Supplier 4: Avnet; Supplier Part Number 4: 0530470410
R112 = TC0225B300JTCC: Resistor: thin film; SMD; 0402; 30Ω; 62.5mW; ±0.1%; TC25; 25V; -55÷155°C; Manufacturer: Uniroyal; Supplier 1: LCSC; Supplier Part Number 1: C50670254; Manufacturer Part Number: TC0225B300JTCC; Category: Uncategorized; Stock 1: 4950; Pricing 1: 50=0.0203, 500=0.0161, 1500=0.0137, 10000=0.0123, 20000=0.0111, 50000=0.0104 (USD); ComponentLink1URL: https://datasheet.octopart.com:443/TC0225B300JTCC-Uniroyal-datasheet-194228366.pdf?src-supplier=LCSC; ComponentLink1Description: https://datasheet.octopart.com:443/TC0225B300JTCC-Uniroyal-datasheet-194228366.pdf?src-supplier=LCSC; Resistance: 30R